# Altium schematic sheet RFMC_DAC.SchDoc: RFSoC AMC
size 420 x 297 mm; CompanyName: WUT; DrawnBy: T. Przywozki; Organization: WUT ISE; Address1: Warsaw University of Technology; Address2: Nowowiejska 15/19 00-665 Warsaw; Address3: Tomasz.Przywozki@pw.edu.pl; DocumentNumber: 43; Revision: 1; SheetNumber: 43; SheetTotal: 45; Project: RFSoC AMC; ModifiedBy: T. Przywozki; CreateDate: -; CheckedDate: -; DivGrp: ISE; Designer: T. Przywozki; ModifiedDate: -; ProjectName: ADC/DAC MEZZANINE
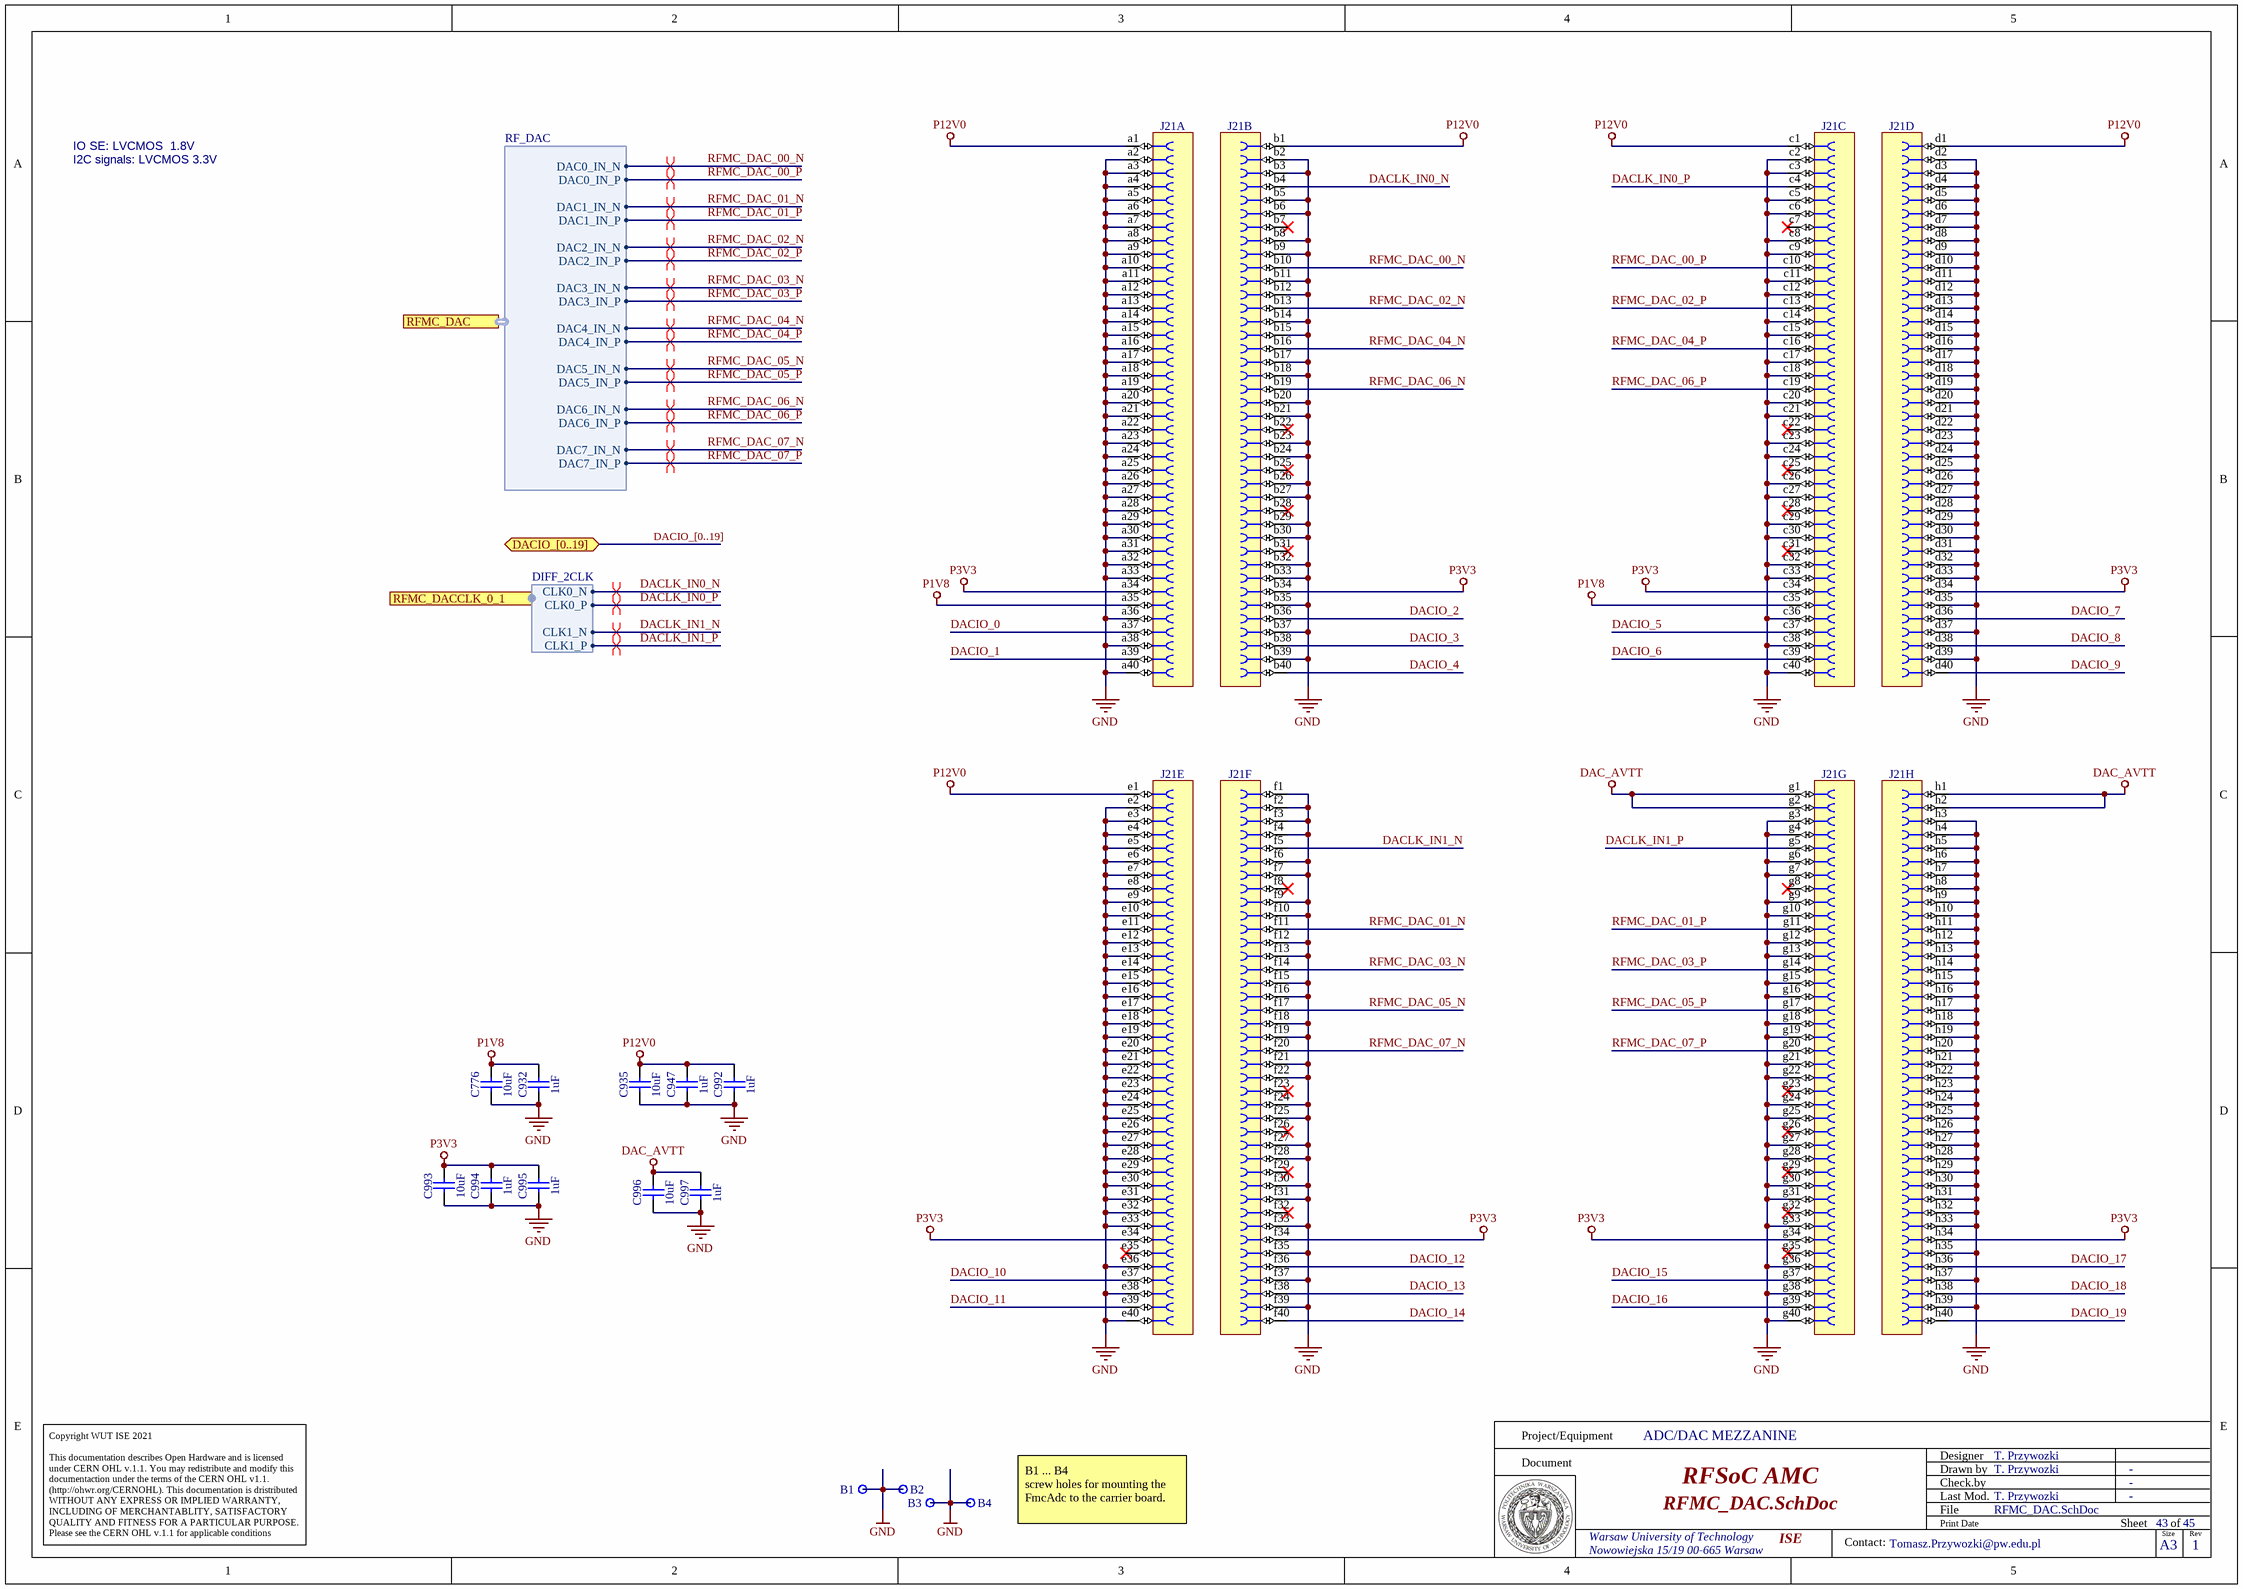
[diagram p0: RFMC_DAC.SchDoc]

## Parts
B1  Plated Hole  [MTG270_500]  (value not drawn)
B2  Plated Hole  [MTG270_500]  (value not drawn)
B3  Plated Hole  [MTG270_500]  (value not drawn)
B4  Plated Hole  [MTG270_500]  (value not drawn)
C776  10uF  [CAPC1608X80N]
C932  1uF  [CAPC1005X55N]
C935  10uF  [CAPC1608X80N]
C947  1uF  [CAPC1005X55N]
C992  1uF  [CAPC1005X55N]
C993  10uF  [CAPC1608X80N]
C994  1uF  [CAPC1005X55N]
C995  1uF  [CAPC1005X55N]
C996  10uF  [CAPC1608X80N]
C997  1uF  [CAPC1005X55N]
J21  (no value)  [SAMTEC_LPAF-40-03.0-S-08]  (parts A,B,C,D,E,F,G,H of 8)

## Ports
DACIO_[0..19] (bidir), RFMC_DAC (harness RF_DAC), RFMC_DACCLK_0_1 (harness DIFF_2CLK)

## Harnesses
RF_DAC: DAC0_IN_N, DAC0_IN_P, DAC1_IN_N, DAC1_IN_P, DAC2_IN_N, DAC2_IN_P, DAC3_IN_N, DAC3_IN_P, DAC4_IN_N, DAC4_IN_P, DAC5_IN_N, DAC5_IN_P, DAC6_IN_N, DAC6_IN_P, DAC7_IN_N, DAC7_IN_P
DIFF_2CLK: CLK0_P, CLK0_N, CLK1_P, CLK1_N

## Nets
DAC_AVTT: C996.2 C997.1 J21.g1 J21.g2 J21.h1 J21.h2
GND: B1.1 B2.1 B3.1 B4.1 C776.1 C932.2 C935.1 C947.2 C992.2 C993.1 C994.2 C995.2 C996.1 C997.2 J21.a2 J21.a3 J21.a4 J21.a5 J21.a6 J21.a7 J21.a8 J21.a9 J21.a10 J21.a11 J21.a12 J21.a13 J21.a14 J21.a15 J21.a16 J21.a17 J21.a18 J21.a19 J21.a20 J21.a21 J21.a22 J21.a23 J21.a24 J21.a25 J21.a26 J21.a27 J21.a28 J21.a29 J21.a30 J21.a31 J21.a32 J21.a33 J21.a36 J21.a38 J21.a40 J21.b2 J21.b3 J21.b5 J21.b6 J21.b8 J21.b9 J21.b11 J21.b12 J21.b14 J21.b15 J21.b17 J21.b18 J21.b20 J21.b21 J21.b23 J21.b24 J21.b26 J21.b27 J21.b29 J21.b30 J21.b32 J21.b33 J21.b35 J21.b37 J21.b39 J21.c2 J21.c3 J21.c5 J21.c6 J21.c8 J21.c9 J21.c11 J21.c12 J21.c14 J21.c15 J21.c17 J21.c18 J21.c20 J21.c21 J21.c23 J21.c24 J21.c26 J21.c27 J21.c29 J21.c30 J21.c32 J21.c33 J21.c36 J21.c38 J21.c40 J21.d2 J21.d3 J21.d4 J21.d5 J21.d6 J21.d7 J21.d8 J21.d9 J21.d10 J21.d11 J21.d12 J21.d13 J21.d14 J21.d15 J21.d16 J21.d17 J21.d18 J21.d19 J21.d20 J21.d21 J21.d22 J21.d23 J21.d24 J21.d25 J21.d26 J21.d27 J21.d28 J21.d29 J21.d30 J21.d31 J21.d32 J21.d33 J21.d35 J21.d37 J21.d39 J21.e2 J21.e3 J21.e4 J21.e5 J21.e6 J21.e7 J21.e8 J21.e9 J21.e10 J21.e11 J21.e12 J21.e13 J21.e14 J21.e15 J21.e16 J21.e17 J21.e18 J21.e19 J21.e20 J21.e21 J21.e22 J21.e23 J21.e24 J21.e25 J21.e26 J21.e27 J21.e28 J21.e29 J21.e30 J21.e31 J21.e32 J21.e33 J21.e36 J21.e38 J21.e40 J21.f1 J21.f2 J21.f3 J21.f4 J21.f6 J21.f7 J21.f9 J21.f10 J21.f12 J21.f13 J21.f15 J21.f16 J21.f18 J21.f19 J21.f21 J21.f22 J21.f24 J21.f25 J21.f27 J21.f28 J21.f30 J21.f31 J21.f33 J21.f35 J21.f37 J21.f39 J21.g3 J21.g4 J21.g6 J21.g7 J21.g9 J21.g10 J21.g12 J21.g13 J21.g15 J21.g16 J21.g18 J21.g19 J21.g21 J21.g22 J21.g24 J21.g25 J21.g27 J21.g28 J21.g30 J21.g31 J21.g33 J21.g36 J21.g38 J21.g40 J21.h3 J21.h4 J21.h5 J21.h6 J21.h7 J21.h8 J21.h9 J21.h10 J21.h11 J21.h12 J21.h13 J21.h14 J21.h15 J21.h16 J21.h17 J21.h18 J21.h19 J21.h20 J21.h21 J21.h22 J21.h23 J21.h24 J21.h25 J21.h26 J21.h27 J21.h28 J21.h29 J21.h30 J21.h31 J21.h32 J21.h33 J21.h35 J21.h37 J21.h39
P1V8: C776.2 C932.1 J21.a35 J21.c35
P3V3: C993.2 C994.1 C995.1 J21.a34 J21.b34 J21.c34 J21.d34 J21.e34 J21.f34 J21.g34 J21.h34
P12V0: C935.2 C947.1 C992.1 J21.a1 J21.b1 J21.c1 J21.d1 J21.e1
DACIO_0: J21.a37
DACIO_1: J21.a39
DACIO_2: J21.b36
DACIO_3: J21.b38
DACIO_4: J21.b40
DACIO_5: J21.c37
DACIO_6: J21.c39
DACIO_7: J21.d36
DACIO_8: J21.d38
DACIO_9: J21.d40
DACIO_10: J21.e37
DACIO_11: J21.e39
DACIO_12: J21.f36
DACIO_13: J21.f38
DACIO_14: J21.f40
DACIO_15: J21.g37
DACIO_16: J21.g39
DACIO_17: J21.h36
DACIO_18: J21.h38
DACIO_19: J21.h40
DACLK_IN0_N: J21.b4 ; port RFMC_DACCLK_0_1.CLK0_N
DACLK_IN0_P: J21.c4 ; port RFMC_DACCLK_0_1.CLK0_P
DACLK_IN1_N: J21.f5 ; port RFMC_DACCLK_0_1.CLK1_N
DACLK_IN1_P: J21.g5 ; port RFMC_DACCLK_0_1.CLK1_P
RFMC_DAC_00_N: J21.b10 ; port RFMC_DAC.DAC0_IN_N
RFMC_DAC_00_P: J21.c10 ; port RFMC_DAC.DAC0_IN_P
RFMC_DAC_01_N: J21.f11 ; port RFMC_DAC.DAC1_IN_N
RFMC_DAC_01_P: J21.g11 ; port RFMC_DAC.DAC1_IN_P
RFMC_DAC_02_N: J21.b13 ; port RFMC_DAC.DAC2_IN_N
RFMC_DAC_02_P: J21.c13 ; port RFMC_DAC.DAC2_IN_P
RFMC_DAC_03_N: J21.f14 ; port RFMC_DAC.DAC3_IN_N
RFMC_DAC_03_P: J21.g14 ; port RFMC_DAC.DAC3_IN_P
RFMC_DAC_04_N: J21.b16 ; port RFMC_DAC.DAC4_IN_N
RFMC_DAC_04_P: J21.c16 ; port RFMC_DAC.DAC4_IN_P
RFMC_DAC_05_N: J21.f17 ; port RFMC_DAC.DAC5_IN_N
RFMC_DAC_05_P: J21.g17 ; port RFMC_DAC.DAC5_IN_P
RFMC_DAC_06_N: J21.b19 ; port RFMC_DAC.DAC6_IN_N
RFMC_DAC_06_P: J21.c19 ; port RFMC_DAC.DAC6_IN_P
RFMC_DAC_07_N: J21.f20 ; port RFMC_DAC.DAC7_IN_N
RFMC_DAC_07_P: J21.g20 ; port RFMC_DAC.DAC7_IN_P

Not connected (* = marked no-connect by the designer): J21 b7* b22* b25* b28* b31* c7* c22* c25* c28* c31* e35* f8* f23* f26* f29* f32* g8* g23* g26* g29* g32* g35*

## Buses and harness runs
bus DACIO_[0..19] = port DACIO_[0..19]

## Layout directives
differential pair: DACLK_IN0_N, DACLK_IN0_P, DACLK_IN1_N, DACLK_IN1_P, RFMC_DAC_00_N, RFMC_DAC_00_P, RFMC_DAC_01_N, RFMC_DAC_01_P, RFMC_DAC_02_N, RFMC_DAC_02_P, RFMC_DAC_03_N, RFMC_DAC_03_P, RFMC_DAC_04_N, RFMC_DAC_04_P, RFMC_DAC_05_N, RFMC_DAC_05_P, RFMC_DAC_06_N, RFMC_DAC_06_P, RFMC_DAC_07_N, RFMC_DAC_07_P

## Notes on the sheet
- I2C signals: LVCMOS 3.3V
- IO SE: LVCMOS  1.8V
- (near B4) B1 ... B4
  screw holes for mounting the FmcAdc to the carrier board.
- Project/Equipment
- Document
- Designer
- Drawn by
- Check.by
- Copyright WUT ISE 2021
  This documentation describes Open Hardware and is licensed under CERN OHL v.1.1. You may redistribute and modify this documentaction under the terms of the CERN OHL v1.1.
  (http://ohwr.org/CERNOHL). This documentation is dristributed WITHOUT ANY EXPRESS OR IMPLIED WARRANTY, INCLUDING OF MERCHANTABLITY, SATISFACTORY QUALITY AND FITNESS FOR A PARTICULAR PURPOSE. Please see the CERN OHL v.1.1 for applicable conditions
- File
- Last Mod.
- Print Date
- Sheet
- Size
- A3
- of
- Rev
- Contact:

## Library data of the parts
B1-B4 = PLATED_HOLE2.7_PAD5.0: Single Terminal Socket; Part Description: Plated Through Hole: Hole Dia.=2.7mm Pad Dia.=5.0mm; Mounted: No; Part Number: PLATED_HOLE2.7_PAD5.0; Component Kind: Standard (No BOM); Component Type: Standard (No BOM); Pin Count: 1; Family: Plated Hole; Socket: No; SMD: No; Sense: No; Status: None; ComponentHeight: 0mm; HelpURL: Undefined; Author: CERN DEM JMW; CreateDate: 27.09.2011; LatestRevisionDate: 27.09.2011; PackageDescription: Plated Through Hole: Hole Dia.=2.7mm Pad Dia.=5.0mm
C776 C935 C993 C996 = CC0603_10UF_10V_10%_X5R: Non-polarised capacitor; Part Description: SMD Multilayer Chip Ceramic Capacitor; Manufacturer: GENERIC; Manufacturer1 Part Number: GRM188R61A106KE69D; Voltage: 10V; TC: X5R; Tolerance: ±10%; Part Number: CC0603_10UF_10V_10%_X5R; Component Kind: Standard; Component Type: Standard; Pin Count: 2; Value: 10uF; Status: None; Manufacturer Part Number: CC0603_10UF_10V_10%_X5R; Case: 0603; Mounted: Yes; Socket: No; SMD: Yes; Sense: No; Manufacturer1 Example: MURATA; Manufacturer1 ComponentHeight: 0.8mm; HelpURL: \\cern.ch\dfs\Applications\Altium\Datasheets\CC0603_MURATA_GRM188R61A106KE69D.pdf; Author: CERN DEM JLC; CreateDate: 31.01.2017; LatestRevisionDate: 31.01.2017
C932 C947 C992 C994 C995 C997 = CC0402_1UF_16V_10%_X5R: Non-polarised capacitor; Part Description: SMD Multilayer Chip Ceramic Capacitor; Manufacturer: GENERIC; Manufacturer1 Part Number: C1005X5R1C105KT; Voltage: 16V; TC: X5R; Tolerance: ±10%; Part Number: CC0402_1UF_16V_10%_X5R; Component Kind: Standard; Component Type: Standard; Pin Count: 2; Value: 1uF; Status: Preferred; Manufacturer Part Number: CC0402_1UF_16V_10%_X5R; Case: 0402; Mounted: Yes; Socket: No; SMD: Yes; Sense: No; Manufacturer1 Example: TDK; Manufacturer1 ComponentHeight: 0.55mm; HelpURL: \\cern.ch\dfs\Applications\Altium\Datasheets\CC0402_X5R_TDK_C.pdf; Author: CERN DEM JLC; CreateDate: 25.10.2012; LatestRevisionDate: 25.10.2012
J21 = SAMTEC_LPAF-40-03.0-S-08-2-K: Connector 320 Female contacts in 8 row abcdef; Part Description: 320 Contacts (8x40), Pitch 1.27mm, Straight High Speed Low-Profile Open-Pin-Field Socket; Manufacturer: SAMTEC; PressFit: No; Sense Comment: Solder Paste Deposition Sensitive – Check Manufacturer Recommendations for Stencil Design; Part Number: SAMTEC_LPAF-40-03.0-S-08-2-K; Component Kind: Standard; Component Type: Standard; Pin Count: 320; Mounted: Yes; Socket: No; SMD: Yes; Sense: Yes; Status: None; Manufacturer Part Number: LPAF-40-03.0-S-08-2-K; ComponentHeight: 2.79mm; HelpURL: \\cern.ch\dfs\Applications\Altium\Datasheets\SAMTEC_LPAF-40-03.0-S-08-2-K.pdf; Author: CERN DEM BC; CreateDate: 02.12.2020; LatestRevisionDate: 02.12.2020